# EAGLE design RetroLink (EAGLE 9.6.2)
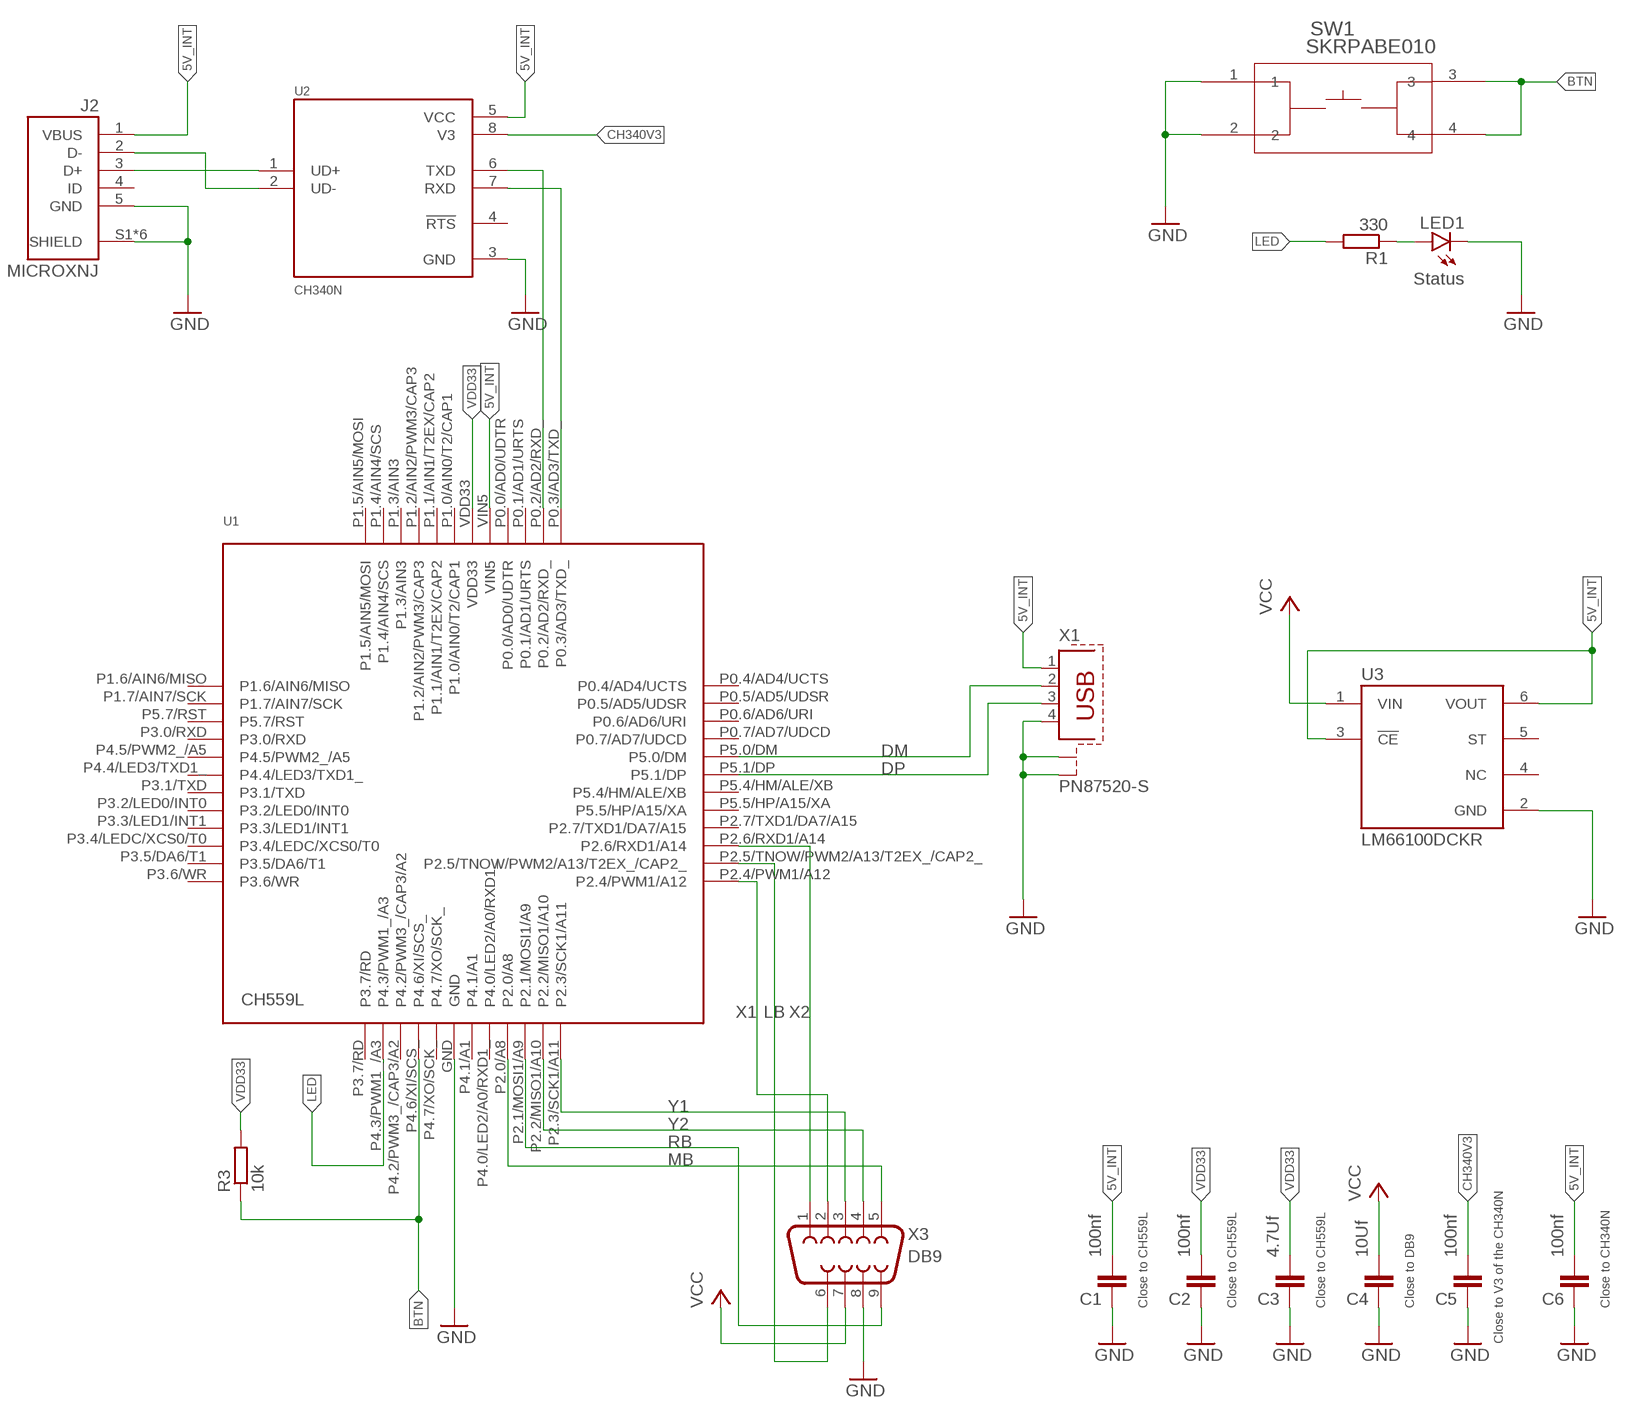
[diagram p0: schematic, sheet 1]

## Parts
C1  100nf  C-EUC0603  [C0603]
C2  100nf  C-EUC0603  [C0603]
C3  4.7Uf  C-EUC0603  [C0603]
C4  10Uf  C-EUC0603  [C0603]
C5  100nf  C-EUC0603  [C0603]
C6  100nf  C-EUC0603  [C0603]
J2  MICROXNJ  [SHOUHAN_MICROXNJ]
LED1  Status  LEDSML0603  [SML0603]
R1  330  R-EU_R0603  [R0603]
R3  10k  R-EU_R0603  [R0603]
SW1  SKRPABE010  [SW4_SKRPABE010_ALPS]
U1  CH559L  [TQFP48_7X7]
U2  CH340N  [SOIC127P600X160-8N]
U3  LM66100DCKR  [SOT65P210X110-6N]
X1  PN87520-S  [PN87520-S]
X3  DB9  F09D  [F09D]

## Nets
5V_INT: C1.2 C6.2 J2.1(VBUS) U1.VIN5 U2.5(VCC) U3.3(!CE) U3.6(VOUT) X1.1
BTN: R3.1 SW1.3 SW1.4 U1.P4.6/XI/SCS_
CH340V3: C5.2 U2.8(V3)
DM: U1.P5.0/DM X1.2
DP: U1.P5.1/DP X1.3
GND: C1.1 C2.1 C3.1 C4.1 C5.1 C6.1 J2.5(GND) J2.S1(SHIELD) J2.S2(SHIELD) J2.S3(SHIELD) J2.S4(SHIELD) J2.S5(SHIELD) J2.S6(SHIELD) LED1.C SW1.1 SW1.2 U1.GND U2.3(GND) U3.2(GND) X1.4 X1.S1 X1.S2 X3.8
LB: U1.P2.5/TNOW/PWM2/A13/T2EX_/CAP2_ X3.6
LED: R1.2 U1.P4.3/PWM1_/A3
MB: U1.P2.0/A8 X3.5
N$5: J2.2(D-) U2.2(UD-)
N$6: J2.3(D+) U2.1(UD+)
RB: U1.P2.1/MOSI1/A9 X3.9
RXD: U1.P0.2/AD2/RXD_ U2.6(TXD)
TXD: U1.P0.3/AD3/TXD_ U2.7(RXD)
VCC: C4.2 U3.1(VIN) X3.7
VDD33: C2.2 C3.2 R3.2 U1.VDD33
VLED: LED1.A R1.1
X1: U1.P2.4/PWM1/A12 X3.2
X2: U1.P2.6/RXD1/A14 X3.1
Y1: U1.P2.3/SCK1/A11 X3.3
Y2: U1.P2.2/MISO1/A10 X3.4
Unconnected: J2.4(ID) U1.P0.0/AD0/UDTR U1.P0.1/AD1/URTS U1.P0.4/AD4/UCTS U1.P0.5/AD5/UDSR U1.P0.6/AD6/URI U1.P0.7/AD7/UDCD U1.P1.0/AIN0/T2/CAP1 U1.P1.1/AIN1/T2EX/CAP2 U1.P1.2/AIN2/PWM3/CAP3 U1.P1.3/AIN3 U1.P1.4/AIN4/SCS U1.P1.5/AIN5/MOSI U1.P1.6/AIN6/MISO U1.P1.7/AIN7/SCK U1.P2.7/TXD1/DA7/A15 U1.P3.0/RXD U1.P3.1/TXD U1.P3.2/LED0/INT0 U1.P3.3/LED1/INT1 U1.P3.4/LEDC/XCS0/T0 U1.P3.5/DA6/T1 U1.P3.6/WR U1.P3.7/RD U1.P4.0/LED2/A0/RXD1_ U1.P4.1/A1 U1.P4.2/PWM3_/CAP3/A2 U1.P4.4/LED3/TXD1_ U1.P4.5/PWM2_/A5 U1.P4.7/XO/SCK_ U1.P5.4/HM/ALE/XB U1.P5.5/HP/A15/XA U1.P5.7/RST U2.4(!RTS) U3.4(NC) U3.5(ST)

## Notes on the sheet
- Close to CH559L | Close to CH559L | Close to CH559L | Close to DB9 | Close to CH340N
- Close to V3 of the CH340N

## Library data of the parts
C1-C6 = rcl:C-EU: CAPACITOR, European symbol; SPICEPREFIX: C
J2 = MICROXNJ:MICROXNJ: Check availability <https://pricing.snapeda.com/parts/MICROXNJ/Shouhan/view-part?ref=eda>; AVAILABILITY: Not in stock; CHECK_PRICES: https://www.snapeda.com/parts/MICROXNJ/Shouhan/view-part/?ref=eda; DESCRIPTION: Sensor Cables / Actuator Cables; MF: Shouhan; MP: MICROXNJ; PACKAGE: Package; PRICE: None; SNAPEDA_LINK: https://www.snapeda.com/parts/MICROXNJ/Shouhan/view-part/?ref=snap
LED1 = led:LED: LED OSRAM: - CHIPLED LG R971, LG N971, LY N971, LG Q971, LY Q971, LO R971, LY R971 LH N974, LH R974 LS Q976, LO Q976, LY Q976 LO Q996 - Hyper CHIPLED LW Q18S LB Q993, LB Q99A, LB R99A - SideLED LS A670, LO A670, LY A670, LG A670, LP A670 LB A673, LV A673, LT A673, LW A673 LH A674 LY A675 LS A676, LA A676, LO A676, LY A676, LW A676 LS A679, LY A679, LG A679 - Hyper Micro SIDELED® LS Y876, LA Y876, LO Y876, LY Y876 LT Y87S - SmartLED LW L88C, LW L88S LB L89C, LB L89S, LG L890 LS L89K, LO L89K, LY L89K LS L896, LA L896, LO L896, LY L896 - TOPLED LS T670, LO T670, LY T670, LG T670, LP T670 LSG T670, LSP T670, LSY T670, LOP T670, LYG T670 LG T671, LOG T671, LSG T671 LB T673, LV T673, LT T673, LW T673 LH T674 LS T676, LA T676, LO T676, LY T676, LB T676, LH T676, LSB T676, LW T676 LB T67C, LV T67C, LT T67C, LS T67K, LO T67K, LY T67K, LW E67C LS E67B, LA E67B, LO E67B, LY E67B, LB E67C, LV E67C, LT E67C LW T67C LS T679, LY T679, LG T679 LS T770, LO T770, LY T770, LG T770, LP T770 LB T773, LV T773, LT T773, LW T773 LH T774 LS E675, LA E675, LY E675, LS T675 LS T776, LA T776, LO T776, LY T776, LB T776 LHGB T686 LT T68C, LB T68C - Hyper Mini TOPLED® LB M676 - Mini TOPLED Santana® LG M470 LS M47K, LO M47K, LY M47K Source: http://www.osram.convergy.de LUXEON: - LUMILED® LXK2-PW12-R00, LXK2-PW12-S00, LXK2-PW14-U00, LXK2-PW14-V00 LXK2-PM12-R00, LXK2-PM12-S00, LXK2-PM14-U00 LXK2-PE12-Q00, LXK2-PE12-R00, LXK2-PE12-S00, LXK2-PE14-T00, LXK2-PE14-U00 LXK2-PB12-K00, LXK2-PB12-L00, LXK2-PB12-M00, LXK2-PB14-N00, LXK2-PB14-P00, LXK2-PB14-Q00 LXK2-PR12-L00, LXK2-PR12-M00, LXK2-PR14-Q00, LXK2-PR14-R00 LXK2-PD12-Q00, LXK2-PD12-R00, LXK2-PD12-S00 LXK2-PH12-R00, LXK2-PH12-S00 LXK2-PL12-P00, LXK2-PL12-Q00, LXK2-PL12-R00 Source: www.luxeon.com KINGBRIGHT: KA-3528ASYC Source: www.kingbright.com
R1 R3 = rcl:R-EU_: RESISTOR, European symbol; SPICEPREFIX: R
SW1 = switch:SKRPABE010; COPYRIGHT: Copyright (C) 2026 Ultra Librarian. All rights reserved.; MANUFACTURER_NAME: Alps Electric; MANUFACTURER_PART_NUMBER: SKRPABE010
U1 = CH559L:CH559L
U2 = CH340N:CH340N: Check availability <https://pricing.snapeda.com/parts/CH340N/WCH/view-part?ref=eda>; AVAILABILITY: Not in stock; CHECK_PRICES: https://www.snapeda.com/parts/CH340N/WCH/view-part/?ref=eda; DESCRIPTION: USB to Serial Port Chip; MF: WCH; MP: CH340N; PACKAGE: Package; PRICE: None; SNAPEDA_LINK: https://www.snapeda.com/parts/CH340N/WCH/view-part/?ref=snap
U3 = LM66100DCKR:LM66100DCKR: Check availability <https://pricing.snapeda.com/parts/LM66100DCKR/Texas%20Instruments/view-part?ref=eda>; AVAILABILITY: In Stock; CHECK_PRICES: https://www.snapeda.com/parts/LM66100DCKR/Texas+Instruments/view-part/?ref=eda; DESCRIPTION: 1.5-V to 5.5-V, 1.5-A, 0.5-µA IQ ideal diode with integrated FET; MF: Texas Instruments; MP: LM66100DCKR; PACKAGE: SOT-SC70-6 Texas Instruments; PRICE: None; SNAPEDA_LINK: https://www.snapeda.com/parts/LM66100DCKR/Texas+Instruments/view-part/?ref=snap
X1 = con-berg:PN87520-S; OC_FARNELL: unknown; OC_NEWARK: unknown
X3 = con-subd:F09: SUB-D; OC_FARNELL: unknown; OC_NEWARK: unknown

## Board
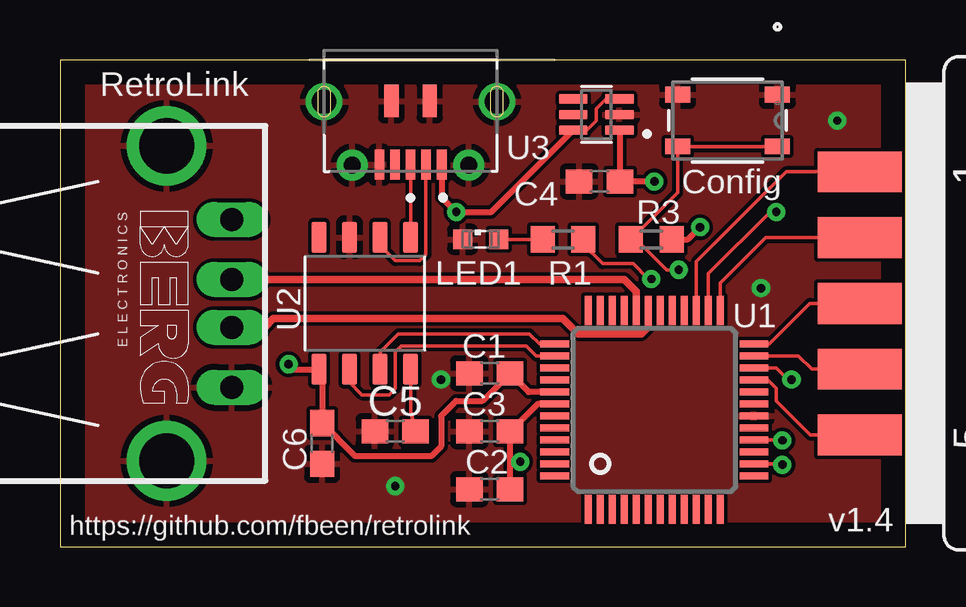
[diagram p1: board, top side]
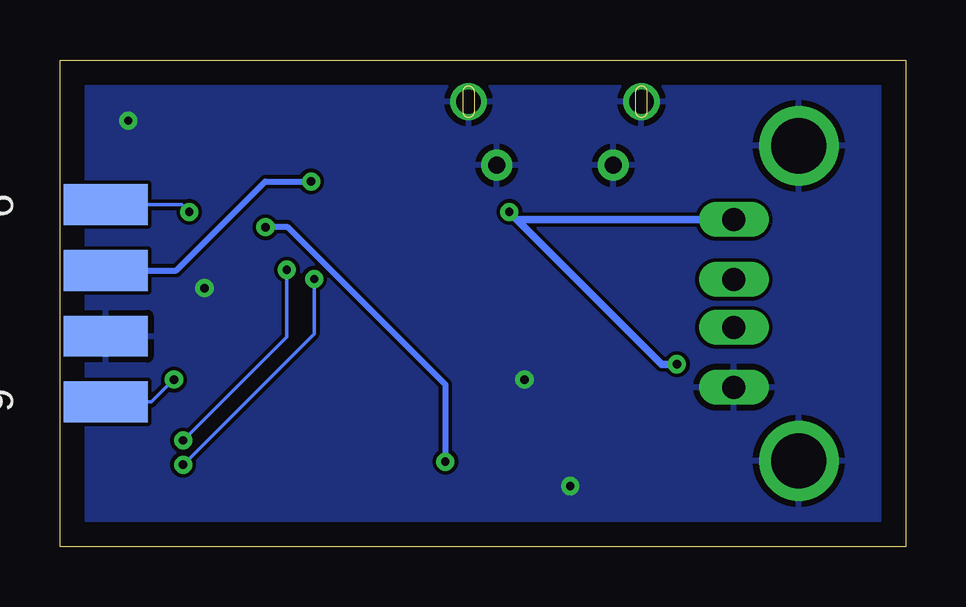
[diagram p2: board, bottom side, seen from below]

Size 35.23 x 20.31 mm. Coordinates in mm from the lower left corner, seen from the top.
Outline: 0,0 35.23,0 35.23,20.31 0,20.31 0,0
Copper layers (1*16): Top 0.035mm / dielectric 1.5mm / Bottom 0.035mm
Design rules "default": minimum track width 6mil, minimum drill 0.35mm, track to track 6mil, track to pad 6mil, pad to pad 6mil, via to via 6mil, smd to smd 6mil, copper to edge 40mil, drill to drill 6mil, minimum pad ring 10mil, minimum via ring 8mil, stop-mask expansion 4mil, vias tented up to drill 0mil, thermal gap 10mil

### Footprints (pad centres in the part's own frame; a part is rotated, then mirrored left to right if it is on the bottom)
C0603 = smd 1.1 x 1: 1 -0.85,0; 2 0.85,0
SHOUHAN_MICROXNJ = smd 0.4 x 1.25: 1 1.3,-4.375; 2 0.65,-4.375; 3 0,-4.375; 4 -0.65,-4.375; 5 -1.3,-4.375 | smd 0.6 x 1.35: S1 -0.8,-1.725; S2 0.8,-1.725 | drill 1.016 pad 1.524: S3 -3.6,-1.75; S6 3.6,-1.75 | drill 0.7 pad 1.3: S4 -2.425,-4.4; S5 2.425,-4.4
SML0603 = smd 0.8 x 0.8: A 0.75,0; C -0.75,0
R0603 = smd 1 x 1.1: 1 -0.85,0; 2 0.85,0
SW4_SKRPABE010_ALPS = smd 0.66 x 1.041: 1 -1.075,2.075; 2 -1.075,-2.075; 3 1.075,2.075; 4 1.075,-2.075
TQFP48_7X7 = smd 0.3 x 1.2: GND -0.25,-4.15; P0.0/AD0/UDTR 1.25,4.15; P0.1/AD1/URTS 1.75,4.15; P0.2/AD2/RXD_ 2.25,4.15; P0.3/AD3/TXD_ 2.75,4.15; P1.0/AIN0/T2/CAP1 -0.25,4.15; P1.1/AIN1/T2EX/CAP2 -0.75,4.15; P1.2/AIN2/PWM3/CAP3 -1.25,4.15; P1.3/AIN3 -1.75,4.15; P1.4/AIN4/SCS -2.25,4.15; P1.5/AIN5/MOSI -2.75,4.15; P2.0/A8 1.25,-4.15; P2.1/MOSI1/A9 1.75,-4.15; P2.2/MISO1/A10 2.25,-4.15; P2.3/SCK1/A11 2.75,-4.15; P3.7/RD -2.75,-4.15; P4.0/LED2/A0/RXD1_ 0.75,-4.15; P4.1/A1 0.25,-4.15; P4.2/PWM3_/CAP3/A2 -1.75,-4.15; P4.3/PWM1_/A3 -2.25,-4.15; P4.6/XI/SCS_ -1.25,-4.15; P4.7/XO/SCK_ -0.75,-4.15; VDD33 0.25,4.15; VIN5 0.75,4.15 | smd 1.2 x 0.3: P0.4/AD4/UCTS 4.15,2.75; P0.5/AD5/UDSR 4.15,2.25; P0.6/AD6/URI 4.15,1.75; P0.7/AD7/UDCD 4.15,1.25; P1.6/AIN6/MISO -4.15,2.75; P1.7/AIN7/SCK -4.15,2.25; P2.4/PWM1/A12 4.15,-2.75; P2.5/TNOW/PWM2/A13/T2EX_/CAP2_ 4.15,-2.25; P2.6/RXD1/A14 4.15,-1.75; P2.7/TXD1/DA7/A15 4.15,-1.25; P3.0/RXD -4.15,1.25; P3.1/TXD -4.15,-0.25; P3.2/LED0/INT0 -4.15,-0.75; P3.3/LED1/INT1 -4.15,-1.25; P3.4/LEDC/XCS0/T0 -4.15,-1.75; P3.5/DA6/T1 -4.15,-2.25; P3.6/WR -4.15,-2.75; P4.4/LED3/TXD1_ -4.15,0.25; P4.5/PWM2_/A5 -4.15,0.75; P5.0/DM 4.15,0.75; P5.1/DP 4.15,0.25; P5.4/HM/ALE/XB 4.15,-0.25; P5.5/HP/A15/XA 4.15,-0.75; P5.7/RST -4.15,1.75
SOIC127P600X160-8N = smd 1.31 x 0.62: 1 -2.75,1.905; 2 -2.75,0.635; 3 -2.75,-0.635; 4 -2.75,-1.905; 5 2.75,-1.905; 6 2.75,-0.635; 7 2.75,0.635; 8 2.75,1.905
SOT65P210X110-6N = smd 1.19 x 0.4: 1 -0.96,0.65; 2 -0.96,0; 3 -0.96,-0.65; 4 0.96,-0.65; 5 0.96,0; 6 0.96,0.65
PN87520-S = drill 0.95 long: 1 -3.5,2.71; 2 -1,2.71; 3 1,2.71; 4 3.5,2.71 | drill 2.3 pad 2.9: S1 -6.57,0; S2 6.57,0
F09D = smd 1.7 x 3.5: 1 -5.486,-6.045; 2 -2.743,-6.045; 3 0,-6.045; 4 2.743,-6.045; 5 5.486,-6.045 | smd 1.7 x 3.5 bottom: 6 -4.115,-6.045; 7 -1.372,-6.045; 8 1.372,-6.045; 9 4.115,-6.045

### Placement (x,y rotation side)
C1  17.91,7.24 0 top
C2  17.91,2.41 0 top
C3  17.91,4.83 0 top
C4  22.48,15.24 0 top
C5  13.97,4.83 0 top
C6  10.92,4.32 90 top
J2  14.61,20.32 0 top
LED1  17.53,12.83 0 top
R1  20.95,12.83 0 top
R3  24.64,12.83 0 top
SW1  27.81,17.78 270 top
U1  24.77,5.72 90 top
U2  12.7,10.16 270 top
U3  22.35,18.03 180 top
X1  4.45,10.16 270 top
X3  39.37,10.16 270 top

### Tracks (layer width: path | path; a pad name or v marks a point on that pad's centre or on a via)
5V_INT  (via drill 0.35)
  Top 0.152: U3.3 23.3,18.67 22.73,18.67 22.35,18.29 22.35,17.78 21.96,17.38 U3.6
  Top 0.254: v9.53,7.62 9.73,7.41 U2.5 10.92,7.28 C6.2 12.28,3.81 15.49,3.81 15.88,4.19 15.88,5.46 16.51,6.1 17.61,6.1 C1.2 19.53,6.47 U1.VIN5 | U3.6 17.98,13.97 v16.51,13.97 15.9,14.57 J2.1
  Bottom 0.305: X1.1 16.2,13.66 v16.51,13.97 10.16,7.62 v9.53,7.62
BTN  (via drill 0.35)
  Top 0.152: SW1.3 SW1.4 25.74,14.78 R3.1 24,12.83 25.27,11.56 v25.78,11.56 | U1.P4.6/XI/SCS_ 30.08,4.46 v30.1,4.45
  Bottom 0.152: v25.78,11.56 25.78,8.76 v30.1,4.45
CH340V3
  Top 0.152: C5.2 14.61,5.64 U2.8
DM
  Top 0.305: U1.P5.0/DM 24.02,10.66 23.51,11.16 8.62,11.16 X1.2
DP
  Top 0.152: U1.P5.1/DP
  Top 0.305: X1.3 8.53,9.16 8.89,9.52 20.95,9.52 21.59,8.89 24.22,8.89 24.51,9.18 U1.P5.1/DP
GND  (via drill 0.35)
  other vias: 13.97,2.54 29.21,10.8 32.38,17.78 15.88,6.99
  pour Top: 0,20.32 35.31,20.32 35.31,0 0,0
  pour Bottom: 0,20.32 35.31,20.32 35.31,0 0,0
LB  (via drill 0.35)
  Top 0.152: U1.P2.5/TNOW/PWM2/A13/T2EX_/CAP2_ 27.02,11.39 29.59,13.97 v29.84,13.97
  Bottom 0.152: X3.6 30.15,14.28 v29.84,13.97
LED  (via drill 0.35)
  Top 0.152: 21.8,12.61 22.61,11.81 23.88,11.81 24.51,11.18 v24.64,11.18 | U1.P4.3/PWM1_/A3 30.06,3.46 v30.1,3.43
  Top 0.254: R1.2 21.8,12.61
  Bottom 0.152: v24.64,11.18 24.64,8.89 v30.1,3.43
MB
  Top 0.152: U1.P2.0/A8 28.93,6.99 29.47,6.99 29.84,6.61 29.84,6.1 31.27,4.67 X3.5
N$5
  Top 0.152: U2.2 13.34,12.57 13.97,11.94 14.99,11.94 15.24,12.19 15.24,15.93 J2.2
N$6
  Top 0.152: J2.3 U2.1
RB  (via drill 0.35)
  Top 0.152: U1.P2.1/MOSI1/A9 29.84,7.47 30.32,6.99 v30.48,6.99
  Bottom 0.152: X3.9 31.42,6.05 v30.48,6.99
RXD
  Top 0.152: U2.6 12.06,6.86 12.57,6.35 13.72,6.35 13.97,6.6 13.97,8.13 14.22,8.38 19.43,8.38 19.85,7.97 U1.P0.2/AD2/RXD_
TXD
  Top 0.152: U2.7 13.34,8.13 14.1,8.89 19.56,8.89 19.98,8.46 U1.P0.3/AD3/TXD_
VCC  (via drill 0.35)
  Top 0.254: v24.77,15.24 C4.2 23.33,17.37 U3.1
  Bottom 0.254: v24.77,15.24 26.67,15.24 30.38,11.53 X3.7
VDD33  (via drill 0.35)
  Top 0.254: U1.VDD33 19.9,5.97 C3.2 18.76,3.56 | C2.2 18.76,3.56 | 18.76,3.56 v19.18,3.56 | R3.2 26.16,12.83 v26.67,13.34
  Bottom 0.254: v26.67,13.34 26.65,13.36 25.76,13.36 19.18,6.77 v19.18,3.56
VLED
  Top 0.152: R1.1 LED1.A
X1
  Top 0.152: U1.P2.4/PWM1/A12 27.52,11 29.41,12.9 X3.2
X2
  Top 0.152: X3.1 30.25,15.65 26.52,11.91 U1.P2.6/RXD1/A14
Y1
  Top 0.152: U1.P2.3/SCK1/A11 29.55,8.46 31.18,10.09 31.25,10.16 X3.3
Y2
  Top 0.152: X3.4 31.32,7.42 30.77,7.97 U1.P2.2/MISO1/A10

### Text on the board
tNames: RetroLink | Config | https://github.com/fbeen/retrolink | v1.4